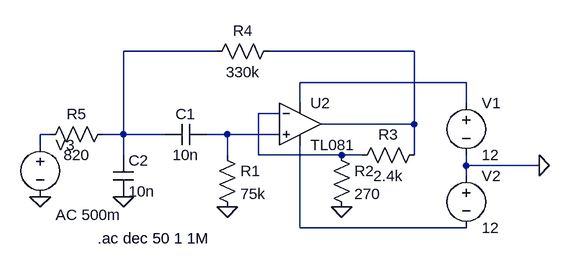
[diagram p0: schematic p2e1.asc]
p2e1.asc, the LTspice schematic file:
Version 4
SHEET 1 880 680
WIRE 224 32 80 32
WIRE 528 32 304 32
WIRE 608 80 352 80
WIRE 352 112 352 80
WIRE 608 112 608 80
WIRE 320 128 288 128
WIRE 528 144 528 32
WIRE 528 144 384 144
WIRE -32 160 -48 160
WIRE 80 160 80 32
WIRE 80 160 48 160
WIRE 144 160 80 160
WIRE 240 160 208 160
WIRE 320 160 240 160
WIRE -48 176 -48 160
WIRE 80 192 80 160
WIRE 240 192 240 160
WIRE 288 192 288 128
WIRE 416 192 288 192
WIRE 448 192 416 192
WIRE 528 192 528 144
WIRE 608 208 608 192
WIRE 720 208 608 208
WIRE 608 224 608 208
WIRE 352 304 352 176
WIRE 608 304 352 304
FLAG 720 208 0
FLAG -48 256 0
FLAG 416 272 0
FLAG 240 272 0
FLAG 80 256 0
SYMBOL AutoGenerated\\TL081 352 144 R0
SYMATTR InstName U2
SYMBOL voltage 608 96 R0
WINDOW 123 0 0 Left 0
WINDOW 39 0 0 Left 0
SYMATTR InstName V1
SYMATTR Value 12
SYMBOL voltage 608 208 R0
WINDOW 123 0 0 Left 0
WINDOW 39 0 0 Left 0
SYMATTR InstName V2
SYMATTR Value 12
SYMBOL voltage -48 160 R0
WINDOW 123 24 124 Left 2
WINDOW 39 0 0 Left 0
SYMATTR Value2 AC 500m
SYMATTR InstName V3
SYMATTR Value ""
SYMBOL cap 208 144 R90
WINDOW 0 0 32 VBottom 2
WINDOW 3 32 32 VTop 2
SYMATTR InstName C1
SYMATTR Value 10n
SYMBOL cap 64 192 R0
SYMATTR InstName C2
SYMATTR Value 10n
SYMBOL res 224 176 R0
SYMATTR InstName R1
SYMATTR Value 75k
SYMBOL res 400 176 R0
SYMATTR InstName R2
SYMATTR Value 270
SYMBOL res 544 176 R90
WINDOW 0 0 56 VBottom 2
WINDOW 3 32 56 VTop 2
SYMATTR InstName R3
SYMATTR Value 2.4k
SYMBOL res 320 16 R90
WINDOW 0 0 56 VBottom 2
WINDOW 3 32 56 VTop 2
SYMATTR InstName R4
SYMATTR Value 330k
SYMBOL res 64 144 R90
WINDOW 0 0 56 VBottom 2
WINDOW 3 32 56 VTop 2
SYMATTR InstName R5
SYMATTR Value 820
TEXT 40 320 Left 2 !.ac dec 50 1 1M

The netlist it stands for:
* p2e1.asc
* U2: TL081 (symbol AutoGenerated\TL081 not available, pins judged from their places): In+=N006 In-=N004 V+=N003 V-=N007 OUT=N002
V1 N003 0 12
V2 0 N007 12
V3 N005 0 AC 500m
C1 N006 N001 10n
C2 N001 0 10n
R1 N006 0 75k
R2 N004 0 270
R3 N002 N004 2.4k
R4 N002 N001 330k
R5 N001 N005 820
.ac dec 50 1 1M
.backanno
.end